# Altium schematic sheet 电子脚铐便携式主控板-Key.SchDoc
size A4
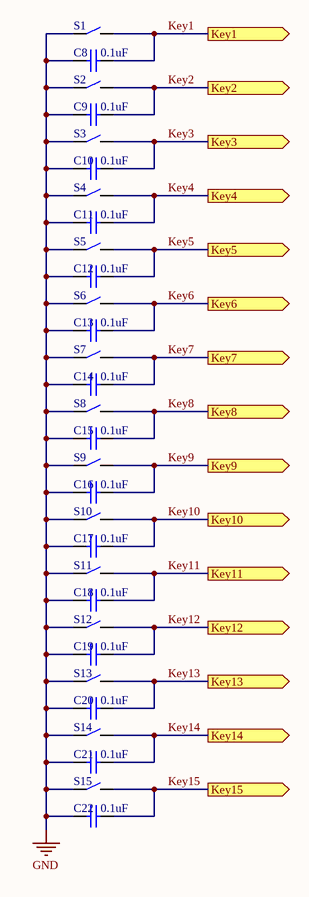
[diagram p0: 电子脚铐便携式主控板-Key.SchDoc]

## Parts
C8  0.1uF  [C0603]
C9  0.1uF  [C0603]
C10  0.1uF  [C0603]
C11  0.1uF  [C0603]
C12  0.1uF  [C0603]
C13  0.1uF  [C0603]
C14  0.1uF  [C0603]
C15  0.1uF  [C0603]
C16  0.1uF  [C0603]
C17  0.1uF  [C0603]
C18  0.1uF  [C0603]
C19  0.1uF  [C0603]
C20  0.1uF  [C0603]
C21  0.1uF  [C0603]
C22  0.1uF  [C0603]
S1  Switch  [B3F-4055]  (value not drawn)
S2  Switch  [B3F-4055]  (value not drawn)
S3  Switch  [B3F-4055]  (value not drawn)
S4  Switch  [B3F-4055]  (value not drawn)
S5  Switch  [B3F-4055]  (value not drawn)
S6  Switch  [B3F-4055]  (value not drawn)
S7  Switch  [B3F-4055]  (value not drawn)
S8  Switch  [B3F-4055]  (value not drawn)
S9  Switch  [B3F-4055]  (value not drawn)
S10  Switch  [B3F-4055]  (value not drawn)
S11  Switch  [B3F-4055]  (value not drawn)
S12  Switch  [B3F-4055]  (value not drawn)
S13  Switch  [B3F-4055]  (value not drawn)
S14  Switch  [B3F-4055]  (value not drawn)
S15  Switch  [B3F-4055]  (value not drawn)

## Ports
Key1 (out), Key2 (out), Key3 (out), Key4 (out), Key5 (out), Key6 (out), Key7 (out), Key8 (out), Key9 (out), Key10 (out), Key11 (out), Key12 (out), Key13 (out), Key14 (out), Key15 (out)

## Nets
GND: C8.2 C9.2 C10.2 C11.2 C12.2 C13.2 C14.2 C15.2 C16.2 C17.2 C18.2 C19.2 C20.2 C21.2 C22.2 S1.1 S2.1 S3.1 S4.1 S5.1 S6.1 S7.1 S8.1 S9.1 S10.1 S11.1 S12.1 S13.1 S14.1 S15.1
Key1: C8.1 S1.2 ; port Key1
Key2: C9.1 S2.2 ; port Key2
Key3: C10.1 S3.2 ; port Key3
Key4: C11.1 S4.2 ; port Key4
Key5: C12.1 S5.2 ; port Key5
Key6: C13.1 S6.2 ; port Key6
Key7: C14.1 S7.2 ; port Key7
Key8: C15.1 S8.2 ; port Key8
Key9: C16.1 S9.2 ; port Key9
Key10: C17.1 S10.2 ; port Key10
Key11: C18.1 S11.2 ; port Key11
Key12: C19.1 S12.2 ; port Key12
Key13: C20.1 S13.2 ; port Key13
Key14: C21.1 S14.2 ; port Key14
Key15: C22.1 S15.2 ; port Key15

## Notes on the sheet
- 文件名:
- 审核:
- 制图人:
- 孟浩
- 校对:
- 图号:
- 批准:
- 日期:

## Library data of the parts
C8-C22 = Cap Semi
S1-S15 = Sw